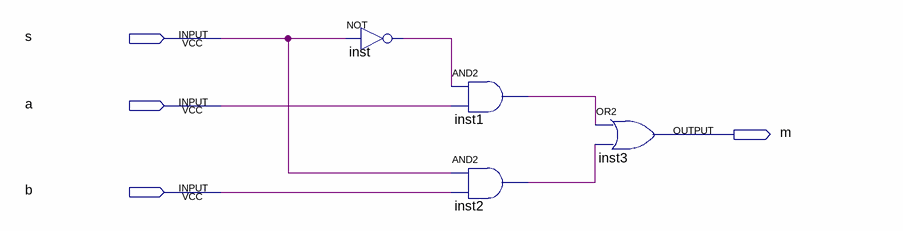
[diagram p0: schematic sheet]
// Quartus schematic MUX2_1_1BIT.bdf as structural Verilog: 4 symbols, 4 pins
module MUX2_1_1BIT (
  input  s,
  input  a,
  input  b,
  output m
);

  wire inst1_out, inst2_out, inst_out;

  not inst (inst_out, s);
  and inst1 (inst1_out, inst_out, a);
  and inst2 (inst2_out, s, b);
  or inst3 (m, inst1_out, inst2_out);
endmodule
